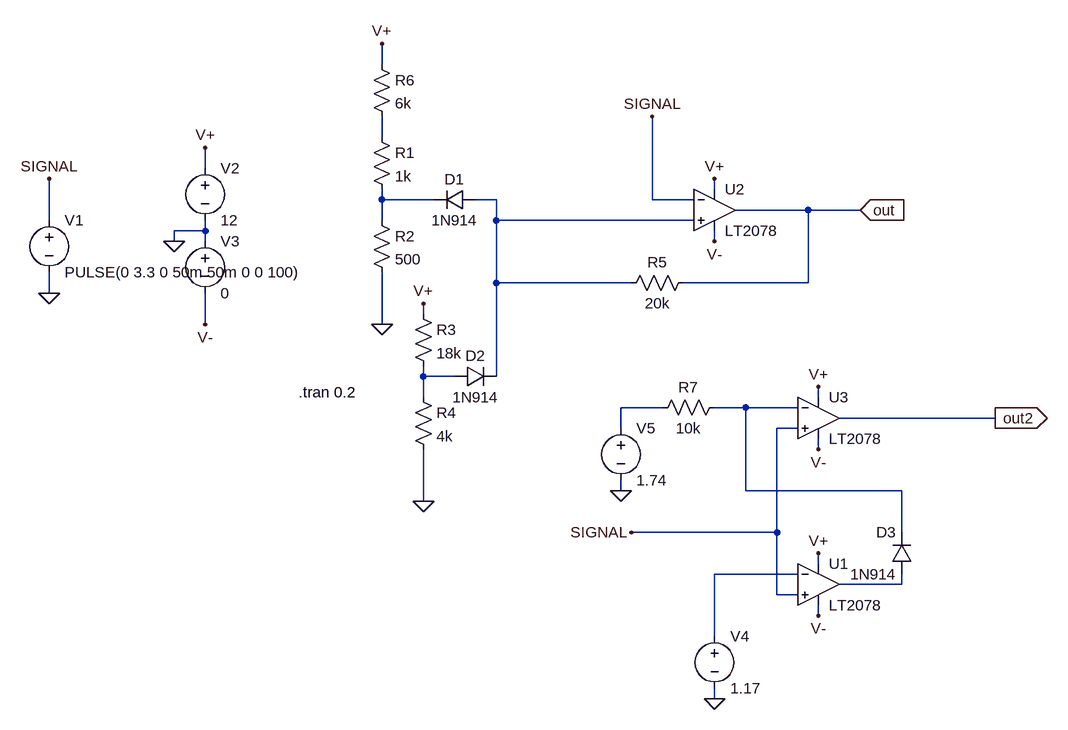
[diagram p0: schematic hysteresis2.asc]
hysteresis2.asc, the LTspice schematic file:
Version 4
SHEET 1 880 1012
WIRE -368 -32 -368 -64
WIRE -368 80 -368 48
WIRE -640 128 -640 96
WIRE 144 160 144 144
WIRE -368 176 -368 160
WIRE -288 176 -368 176
WIRE -192 176 -224 176
WIRE 48 176 48 48
WIRE 112 176 48 176
WIRE 288 192 176 192
WIRE 368 192 288 192
WIRE -880 208 -880 144
WIRE -368 208 -368 176
WIRE -192 208 -192 176
WIRE 112 208 -192 208
WIRE -640 224 -640 208
WIRE -640 224 -688 224
WIRE -688 240 -688 224
WIRE -640 240 -640 224
WIRE 144 240 144 224
WIRE -192 304 -192 208
WIRE 16 304 -192 304
WIRE 288 304 288 192
WIRE 288 304 96 304
WIRE -880 320 -880 288
WIRE -304 352 -304 336
WIRE -640 368 -640 320
WIRE -368 368 -368 288
WIRE -304 448 -304 432
WIRE -256 448 -304 448
WIRE -192 448 -192 304
WIRE -304 480 -304 448
WIRE 304 480 304 464
WIRE 64 496 0 496
WIRE 192 496 144 496
WIRE 272 496 192 496
WIRE 576 512 336 512
WIRE 0 528 0 496
WIRE 272 528 240 528
WIRE 304 560 304 544
WIRE 0 624 0 608
WIRE 192 624 192 496
WIRE 432 624 192 624
WIRE -304 640 -304 560
WIRE 240 688 240 528
WIRE 240 688 16 688
WIRE 432 688 432 624
WIRE 304 736 304 720
WIRE 272 752 144 752
WIRE 432 768 432 752
WIRE 432 768 336 768
WIRE 240 784 240 688
WIRE 272 784 240 784
WIRE 304 816 304 800
WIRE 144 848 144 752
WIRE 144 944 144 928
FLAG -688 240 0
FLAG -640 96 V+
FLAG 144 144 V+
FLAG -640 368 V-
FLAG 144 240 V-
FLAG -880 144 SIGNAL
FLAG -880 320 0
FLAG 368 192 out
IOPIN 368 192 In
FLAG 48 48 SIGNAL
FLAG -368 368 0
FLAG -368 -64 V+
FLAG -304 640 0
FLAG -304 336 V+
FLAG 304 720 V+
FLAG 304 816 V-
FLAG 144 944 0
FLAG 304 464 V+
FLAG 304 560 V-
FLAG 0 624 0
FLAG 16 688 SIGNAL
FLAG 576 512 out2
IOPIN 576 512 Out
SYMBOL voltage -880 192 R0
WINDOW 123 0 0 Left 2
WINDOW 39 0 0 Left 2
SYMATTR InstName V1
SYMATTR Value PULSE(0 3.3 0 50m 50m 0 0 100)
SYMBOL voltage -640 112 R0
WINDOW 123 0 0 Left 2
WINDOW 39 0 0 Left 2
SYMATTR InstName V2
SYMATTR Value 12
SYMBOL voltage -640 224 R0
WINDOW 123 0 0 Left 2
WINDOW 39 0 0 Left 2
SYMATTR InstName V3
SYMATTR Value 0
SYMBOL res -384 64 R0
SYMATTR InstName R1
SYMATTR Value 1k
SYMBOL res -384 192 R0
SYMATTR InstName R2
SYMATTR Value 500
SYMBOL Opamps\\LT2078 144 128 R0
SYMATTR InstName U2
SYMBOL res -320 336 R0
SYMATTR InstName R3
SYMATTR Value 18k
SYMBOL res -320 464 R0
SYMATTR InstName R4
SYMATTR Value 4k
SYMBOL diode -224 160 R90
WINDOW 0 0 32 VBottom 2
WINDOW 3 32 32 VTop 2
SYMATTR InstName D1
SYMATTR Value 1N914
SYMBOL diode -256 464 R270
WINDOW 0 32 32 VTop 2
WINDOW 3 0 32 VBottom 2
SYMATTR InstName D2
SYMATTR Value 1N914
SYMBOL res 112 288 R90
WINDOW 0 0 56 VBottom 2
WINDOW 3 32 56 VTop 2
SYMATTR InstName R5
SYMATTR Value 20k
SYMBOL res -384 -48 R0
SYMATTR InstName R6
SYMATTR Value 6k
SYMBOL Opamps\\LT2078 304 704 R0
SYMATTR InstName U1
SYMBOL voltage 144 832 R0
WINDOW 123 0 0 Left 2
WINDOW 39 0 0 Left 2
SYMATTR InstName V4
SYMATTR Value 1.17
SYMBOL Opamps\\LT2078 304 448 R0
SYMATTR InstName U3
SYMBOL voltage 0 512 R0
WINDOW 123 0 0 Left 2
WINDOW 39 0 0 Left 2
SYMATTR InstName V5
SYMATTR Value 1.74
SYMBOL res 160 480 R90
WINDOW 0 0 56 VBottom 2
WINDOW 3 32 56 VTop 2
SYMATTR InstName R7
SYMATTR Value 10k
SYMBOL diode 448 752 R180
WINDOW 0 24 64 Left 2
WINDOW 3 24 0 Left 2
SYMATTR InstName D3
SYMATTR Value 1N914
TEXT -496 472 Left 2 !.tran 0.2

The netlist it stands for:
* hysteresis2.asc
V1 SIGNAL 0 PULSE(0 3.3 0 50m 50m 0 0 100)
V2 V+ 0 12
V3 0 V- 0
R1 N001 N002 1k
R2 N002 0 500
XU2 N003 SIGNAL V+ V- out LT2078  ; pins In+ In- V+ V- OUT
R3 V+ N004 18k
R4 N004 0 4k
D1 N003 N002 1N914
D2 N004 N003 1N914
R5 out N003 20k
R6 V+ N001 6k
XU1 SIGNAL N007 V+ V- N008 LT2078  ; pins In+ In- V+ V- OUT
V4 N007 0 1.17
XU3 SIGNAL N006 V+ V- out2 LT2078  ; pins In+ In- V+ V- OUT
V5 N005 0 1.74
R7 N006 N005 10k
D3 N008 N006 1N914
.model D D
.lib standard.dio
.tran 0.2
.backanno
.end